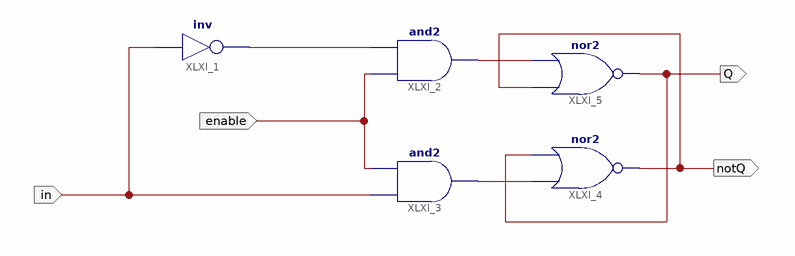
[diagram p0: schematic sheet 1]
// Xilinx ISE schematic d_latch.sch (spartan3e) as structural Verilog: 5 symbols, 4 ports
module d_latch (
  input  enable,
  input  in,
  output notQ,
  output Q
);

  wire XLXN_1, XLXN_2, XLXN_10;

  not XLXI_1 (XLXN_10, in);
  and XLXI_2 (XLXN_1, enable, XLXN_10);
  and XLXI_3 (XLXN_2, in, enable);
  nor XLXI_4 (notQ, XLXN_2, Q);
  nor XLXI_5 (Q, notQ, XLXN_1);
endmodule
